# Altium schematic sheet 9_ZynTra-USB2.0.SchDoc
size 381 x 241 mm; SheetNumber: 9; SheetTotal: 10
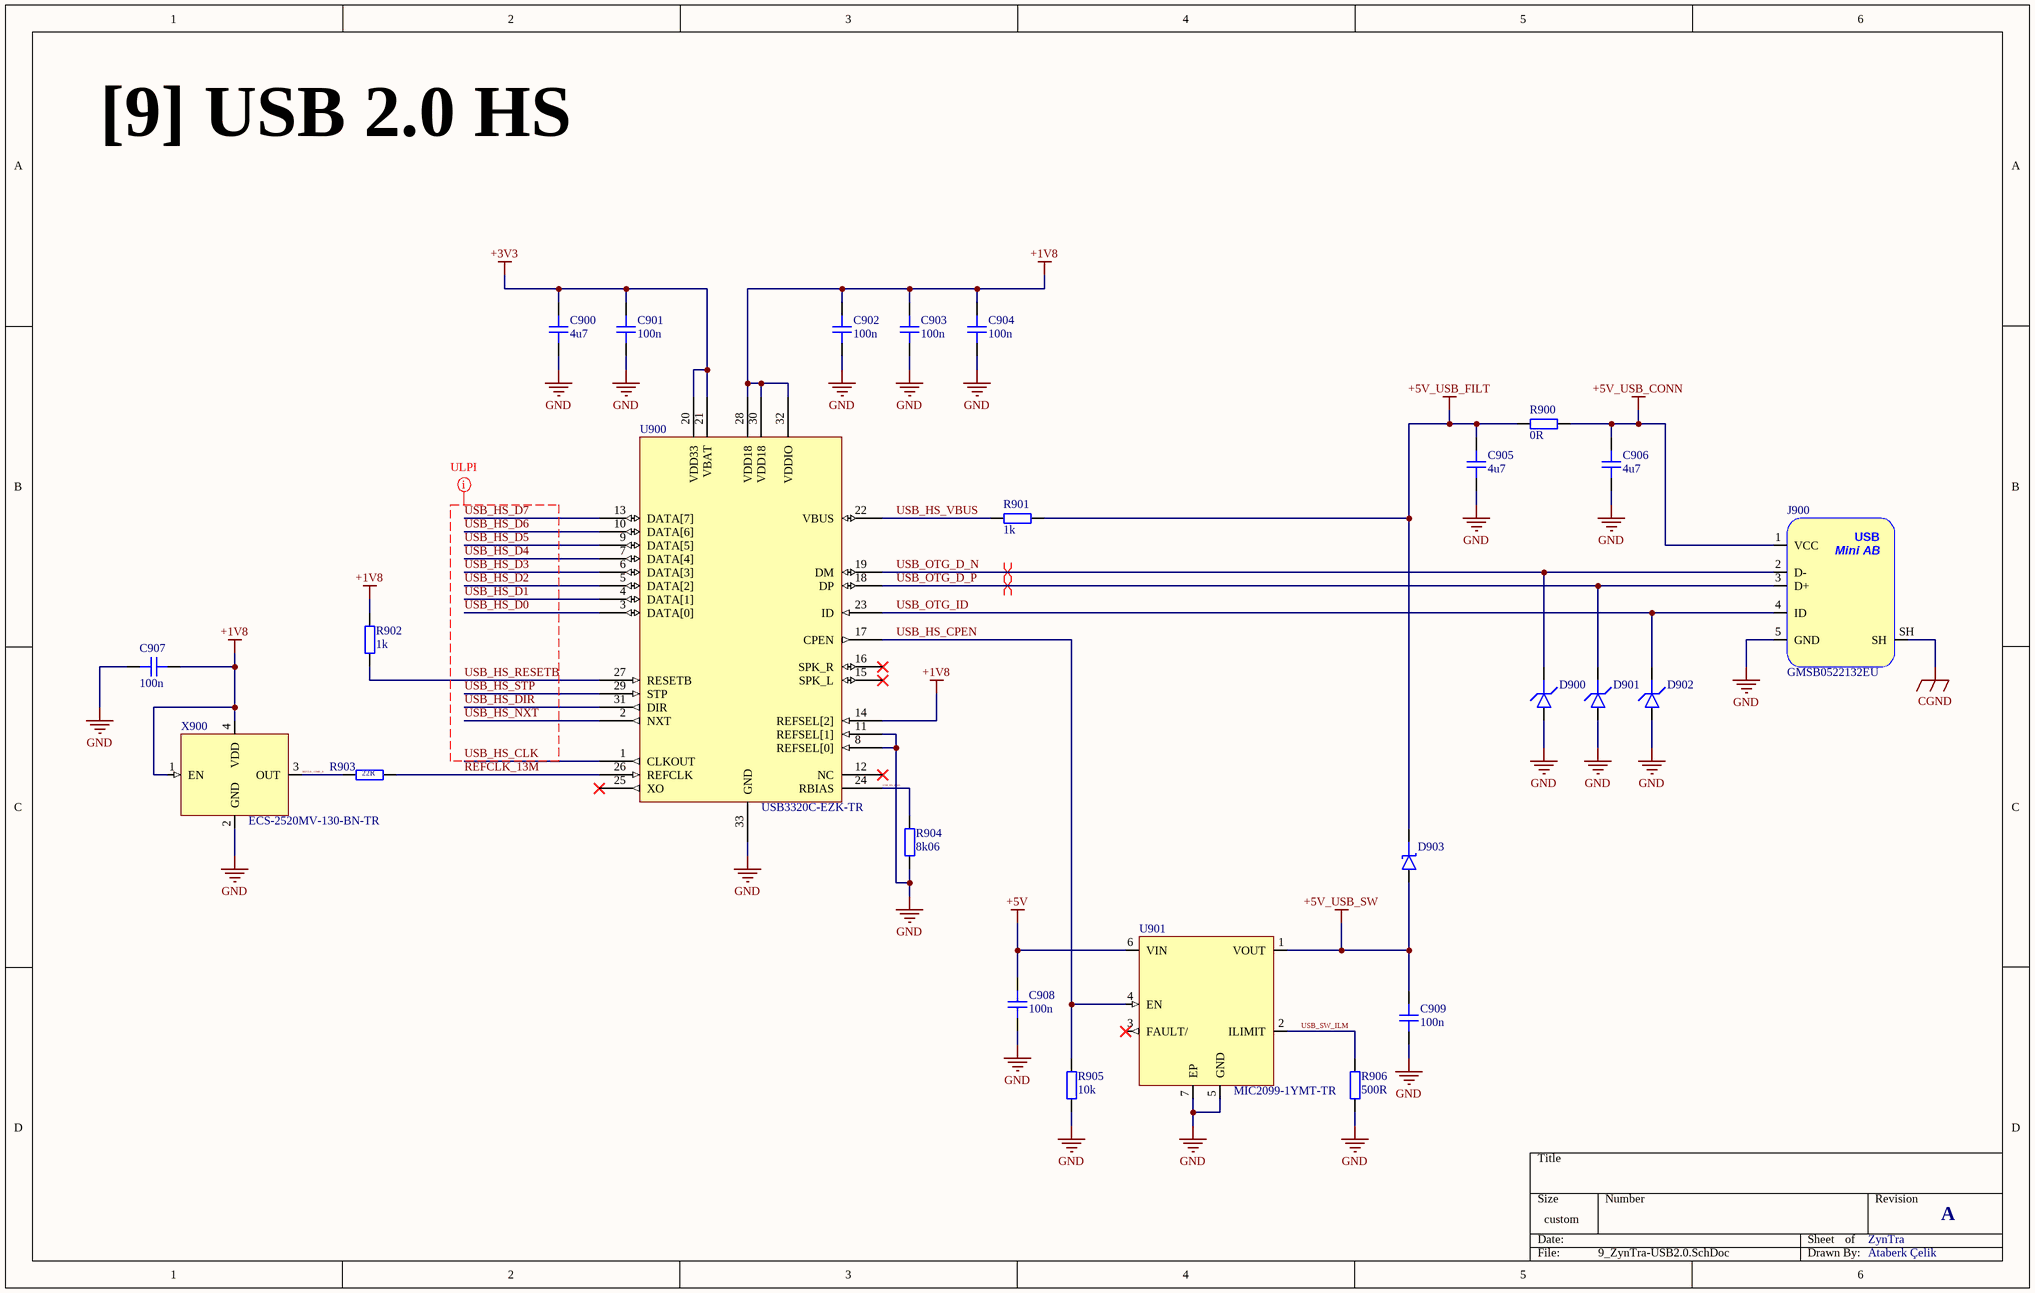
[diagram p0: 9_ZynTra-USB2.0.SchDoc]

## Parts
C900  4u7  [CAP_0402]
C901  100n  [CAP_0201]
C902  100n  [CAP_0201]
C903  100n  [CAP_0201]
C904  100n  [CAP_0201]
C905  4u7  [CAP_0402]
C906  4u7  [CAP_0402]
C907  100n  [CAP_0201]
C908  100n  [CAP_0201]
C909  100n  [CAP_0201]
D900  D_TVS_0402  [D_0402]  (value not drawn)
D901  D_TVS_0402  [D_0402]  (value not drawn)
D902  D_TVS_0402  [D_0402]  (value not drawn)
D903  D_SCHOTTKY_SOD_323  [SOD-323]  (value not drawn)
J900  GMSB0522132EU  [GMSB0522132EU]
R900  0R  [RES_0402]
R901  1k  [RES_0402]
R902  1k  [RES_0402]
R903  22R  [RES_0402]
R904  8k06  [RES_0402]
R905  10k  [RES_0402]
R906  500R  [RES_0402]
U900  USB3320C-EZK-TR  [32-QFN, 5x5mm]
U901  MIC2099-1YMT-TR  [6-1.6x1.6mm TMLF]
X900  ECS-2520MV-130-BN-TR  [XTAL_2520]

## Nets
+1V8: C902.2 C903.2 C904.2 C907.1 R902.2 U900.14(REFSEL[2]) U900.28(VDD18) U900.30(VDD18) U900.32(VDDIO) X900.1(EN) X900.4(VDD)
+3V3: C900.2 C901.2 U900.20(VDD33) U900.21(VBAT)
+5V: C908.2 U901.6(VIN)
+5V_USB_CONN: C906.2 J900.1(VCC) R900.2
+5V_USB_FILT: C905.2 D903.K R900.1 R901.2
+5V_USB_SW: C909.2 D903.A U901.1(VOUT)
CGND: J900.SH
GND: C900.1 C901.1 C902.1 C903.1 C904.1 C905.1 C906.1 C907.2 C908.1 C909.1 D900.A D901.A D902.A J900.5(GND) R904.2 R905.2 R906.2 U900.8(REFSEL[0]) U900.11(REFSEL[1]) U900.33(GND) U901.5(GND) U901.7(EP) X900.2(GND)
REFCLK_13M: R903.2 U900.26(REFCLK)
REFCLK_13MH_R: R903.1 X900.3(OUT)
USB_HS_BIAS: R904.1 U900.24(RBIAS)
USB_HS_CLK: U900.1(CLKOUT)
USB_HS_CPEN: R905.1 U900.17(CPEN) U901.4(EN)
USB_HS_D0: U900.3(DATA[0])
USB_HS_D1: U900.4(DATA[1])
USB_HS_D2: U900.5(DATA[2])
USB_HS_D3: U900.6(DATA[3])
USB_HS_D4: U900.7(DATA[4])
USB_HS_D5: U900.9(DATA[5])
USB_HS_D6: U900.10(DATA[6])
USB_HS_D7: U900.13(DATA[7])
USB_HS_DIR: U900.31(DIR)
USB_HS_NXT: U900.2(NXT)
USB_HS_RESETB: R902.1 U900.27(RESETB)
USB_HS_STP: U900.29(STP)
USB_HS_VBUS: R901.1 U900.22(VBUS)
USB_OTG_D_N: D900.K J900.2(D-) U900.19(DM)
USB_OTG_D_P: D901.K J900.3(D+) U900.18(DP)
USB_OTG_ID: D902.K J900.4(ID) U900.23(ID)
USB_SW_ILM: R906.1 U901.2(ILIMIT)

Not connected (* = marked no-connect by the designer): U900 12(NC)* 15(SPK_L)* 16(SPK_R)* 25(XO)*; U901 3(FAULT/)*

## Layout directives
differential pair: USB_OTG_D_N, USB_OTG_D_P
net class ULPI; rule Matched Net Lengths [Delay Tolerance = 10ps]: USB_HS_CLK, USB_HS_D0, USB_HS_D1, USB_HS_D2, USB_HS_D3, USB_HS_D4, USB_HS_D5, USB_HS_D6, USB_HS_D7, USB_HS_DIR, USB_HS_NXT, USB_HS_RESETB, USB_HS_STP

## Notes on the sheet
- [9] USB 2.0 HS
- ZynTra
- A
- Ataberk Çelik
- (in symbol GMSB0522132EU) USB; Mini AB

## Library data of the parts
C900 C905 C906 = CAP_0402: Capacitor SMD 0402; Manufacturer: *; Manufacturer Part Number: *; Distributor Link: *; LCSC: *; Rating: *; Dielectric: *
C901-C904 C907-C909 = CAP_0201: Capacitor SMD 0201; Manufacturer: *; Manufacturer Part Number: *; Distributor Link: *; LCSC: *; Rating: *; Dielectric: *
D900-D902 = D_TVS_0402: Diode TVS / ESD 0402
D903 = D_SCHOTTKY_SOD_323: Diode Schottky SMD SOD-323
J900 = GMSB0522132EU: USB 2.0 Mini AB Receptacle Right Angle Through-Hole; Manufacturer: Amphenol; Manufacturer Part Number: GMSB0522132EU
R900-R906 = RES_0402: Resistor SMD 0402; Manufacturer: *; Manufacturer Part Number: *; Distributor Link: *; LCSC: *
U900 = USB3320C-EZK-TR: Highly Integrated Full Featured Hi-Speed USB 2.0 ULPI / Transceiver; Manufacturer: Microchip; Manufacturer Part Number: USB3320C-EZK-TR; Supplier Link: https://www.mouser.com.tr/ProductDetail/Microchip-Technology/USB3320C-EZK-TR?qs=pA5MXup5wxFLWWzXkMzUXA%3D%3D
U901 = MIC2099-1YMT-TR: Manufacturer: Microchip; Manufacturer Part Number: MIC2099-1YMT-TR; Supplier Link: https://www.mouser.com.tr/ProductDetail/Microchip-Technology/MIC2099-1YMT-TR?qs=Y3Q3JoKAO1TOfJDYcM%252BPYw%3D%3D
X900 = ECS-2520MV-130-BN-TR: Standard Clock Oscillators XO (Standard),13MHz,Standby (Power Down),CMOS, Multi-Volt,1.6 V 3.6 V,+/-50ppm,-40 C 85 C,6mA,Surface Mount,4-SMD, No Lead,(2.50mm x 2.00mm),(0.80mm); Manufacturer: ECS; Manufacturer Part Number: ECS-2520MV-130-BN-TR